# Altium schematic sheet 3V3_REG.SchDoc
size C; SheetNumber: 9; SheetTotal: 25
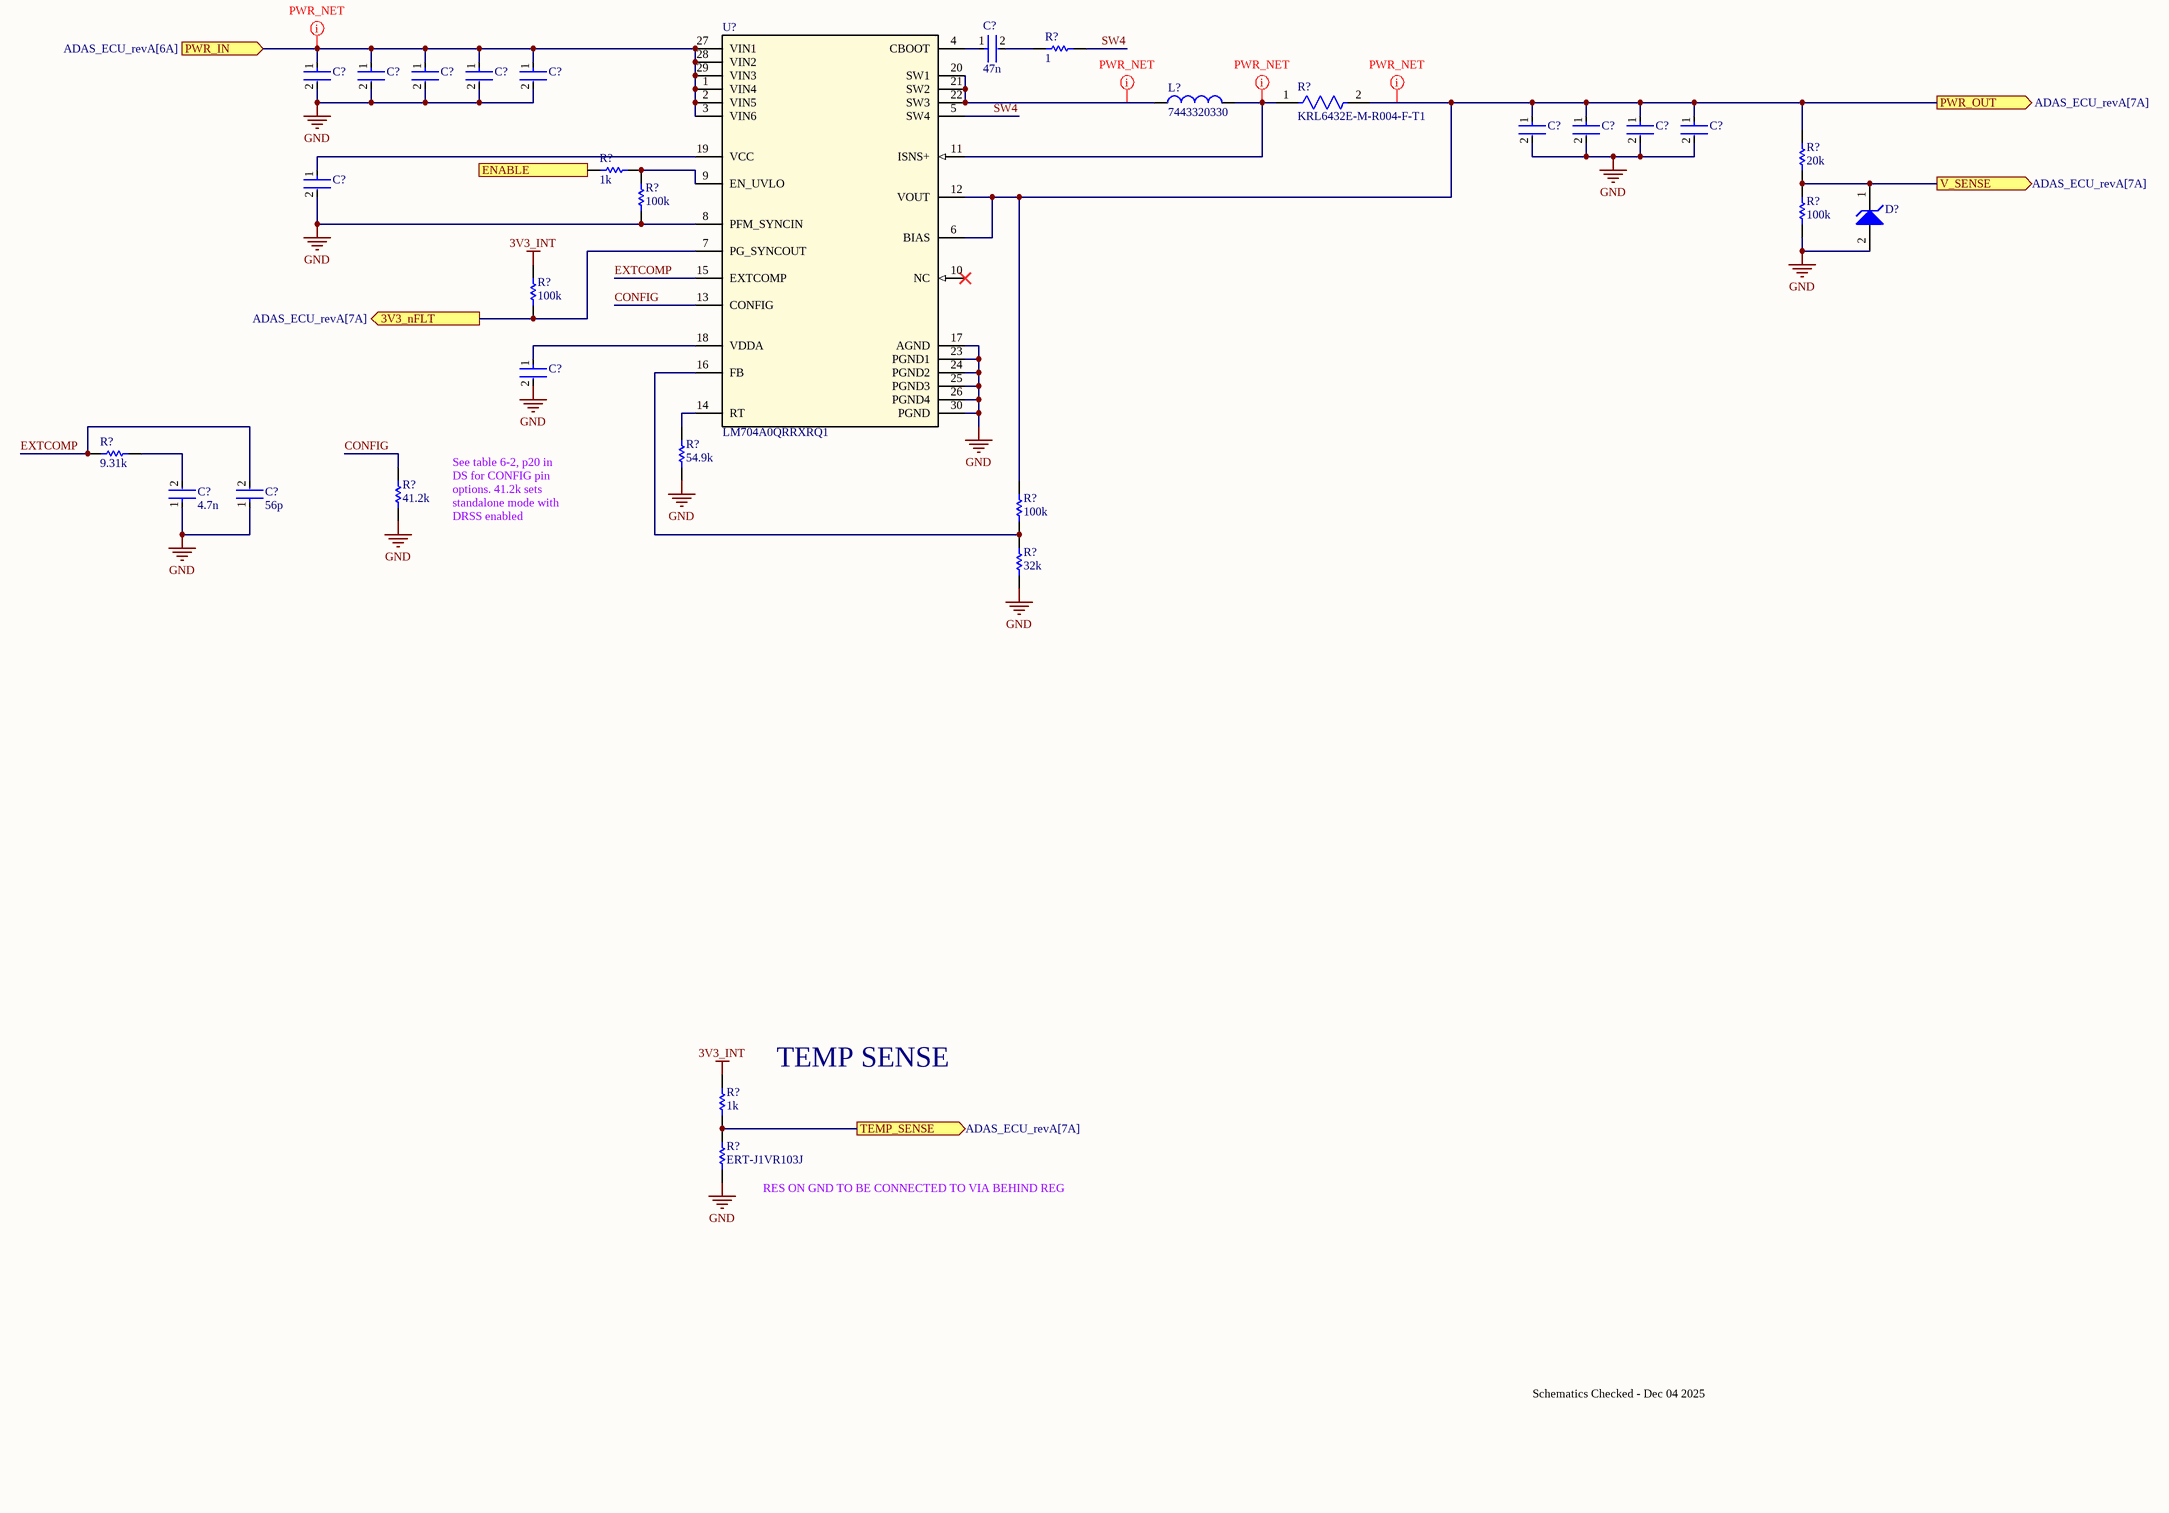
[diagram p0: 3V3_REG.SchDoc]

## Parts
(Parts that share a designator on the sheet are numbered #1, #2 ... from top to bottom, then left to right.)
C?#1  47n  [FP-0402-L_1_0_0_05-W_0_5-IPC_A]
C?#2  C3225X7R1H106M250AC  [FP-C3225-250-0_4-MFG]  (value not drawn)
C?#3  C3225X7R1H106M250AC  [FP-C3225-250-0_4-MFG]  (value not drawn)
C?#4  C3225X7R1H106M250AC  [FP-C3225-250-0_4-MFG]  (value not drawn)
C?#5  C3225X7R1H106M250AC  [FP-C3225-250-0_4-MFG]  (value not drawn)
C?#6  C2012X7R2A104K125AA  [FP-C2012-125-0_2-IPC_B]  (value not drawn)
C?#7  GRM32EC80J107ME20L  [FP-GRM32E-0_3-0_2-IPC_C]  (value not drawn)
C?#8  GRM32EC80J107ME20L  [FP-GRM32E-0_3-0_2-IPC_C]  (value not drawn)
C?#9  GRM32EC80J107ME20L  [FP-GRM32E-0_3-0_2-IPC_C]  (value not drawn)
C?#10  GRM32EC80J107ME20L  [FP-GRM32E-0_3-0_2-IPC_C]  (value not drawn)
C?#11  GRM188R71A225KE15D  [FP-GRM188-0_1-e0_2_0_5-MFG]  (value not drawn)
C?#12  GRM155R61A474KE15D  [FP-GRM15-0_1-MFG]  (value not drawn)
C?#13  4.7n  [FP-0402-L_1_0_0_05-W_0_5-IPC_A]
C?#14  56p  [FP-0402-L_1_0_0_05-W_0_5-IPC_A]
D?  DNP/MM5Z3V3T1G  [ONSC-SOD-523-2-502-01_V]  (value not drawn)
L?  7443320330  [WE-HCC_1210]
R?#1  1  [R0603B]
R?#2  KRL6432E-M-R004-F-T1  [FP-KRL6432E-MFG]
R?#3  20k  [R0603B]
R?#4  1k  [R0603B]
R?#5  100k  [R0603B]
R?#6  100k  [R0603B]
R?#7  100k  [R0603B]
R?#8  9.31k  [R0603B]
R?#9  54.9k  [R0603B]
R?#10  41.2k  [R0603B]
R?#11  100k  [R0603B]
R?#12  32k  [R0603B]
R?#13  1k  [R0603B]
R?#14  ERT-J1VR103J  [RESC1608X90X30ML15T20]
U?  LM704A0QRRXRQ1  [LM704A0QRRXRQ1-Footprint-1]

## Ports
3V3_nFLT (out, see ADAS_ECU_revA[7A]), ENABLE (in), PWR_IN (in, see ADAS_ECU_revA[6A]), PWR_OUT (out, see ADAS_ECU_revA[7A]), TEMP_SENSE (out, see ADAS_ECU_revA[7A]), V_SENSE (out, see ADAS_ECU_revA[7A])

## Nets
3V3_INT: R?#7.2 R?#13.1
GND: C?#2.2 C?#3.2 C?#4.2 C?#5.2 C?#6.2 C?#7.2 C?#8.2 C?#9.2 C?#10.2 C?#11.2 C?#12.2 C?#13.1 C?#14.1 D?.2(A) R?#5.1 R?#6.2 R?#9.2 R?#10.2 R?#12.2 R?#14.1 U?.8(PFM_SYNCIN) U?.17(AGND) U?.23(PGND1) U?.24(PGND2) U?.25(PGND3) U?.26(PGND4) U?.30(PGND)
3V3_nFLT: R?#7.1 U?.7(PG_SYNCOUT) ; port 3V3_nFLT
CONFIG: R?#10.1 U?.13(CONFIG)
ENABLE: R?#4.2 ; port ENABLE
EXTCOMP: C?#14.2 R?#8.1 U?.15(EXTCOMP)
PWR_IN: C?#2.1 C?#3.1 C?#4.1 C?#5.1 C?#6.1 U?.1(VIN4) U?.2(VIN5) U?.3(VIN6) U?.27(VIN1) U?.28(VIN2) U?.29(VIN3) ; port PWR_IN
PWR_OUT: C?#7.1 C?#8.1 C?#9.1 C?#10.1 R?#2.2 R?#3.1 R?#11.1 U?.6(BIAS) U?.12(VOUT) ; port PWR_OUT
SW4: R?#1.2 U?.5(SW4)
TEMP_SENSE: R?#13.2 R?#14.2 ; port TEMP_SENSE
V_SENSE: D?.1(K) R?#3.2 R?#6.1 ; port V_SENSE
NetC?#1_1: C?#1.1 U?.4(CBOOT)
NetC?#1_2: C?#1.2 R?#1.1
NetC?#11_1: C?#11.1 U?.19(VCC)
NetC?#12_1: C?#12.1 U?.18(VDDA)
NetC?#13_2: C?#13.2 R?#8.2
NetL?_1: L?.1 U?.20(SW1) U?.21(SW2) U?.22(SW3)
NetL?_2: L?.2 R?#2.1 U?.11(ISNS+)
NetR?#4_1: R?#4.1 R?#5.2 U?.9(EN_UVLO)
NetR?#9_1: R?#9.1 U?.14(RT)
NetR?#11_2: R?#11.2 R?#12.1 U?.16(FB)

Not connected (* = marked no-connect by the designer): U? 10(NC)*

## Layout directives
net class PWR: NetL?_1, NetL?_2, PWR_IN, PWR_OUT

## Notes on the sheet
- See table 6-2, p20 in DS for CONFIG pin options. 41.2k sets standalone mode with DRSS enabled
- TEMP SENSE
- (near R?#14) RES ON GND TO BE CONNECTED TO VIA BEHIND REG
- Schematics Checked - Dec 04 2025

## Library data of the parts
C?#1 C?#13 C?#14 = CMP-001-00058-1: LARGE PADS, 0402 CAP, CHANGE COMMENT TO MATCH REAL P/N; Capacitor Type: Ceramic; Min Operating Temperature: -55°C; Mounting Technology: Surface Mount; Pins: 2; Case/Package: 0402; RoHS Compliant: Yes; Max Operating Temperature: 85°C
C?#2-C?#5 = CMP-08246-002653-1: Multilayer Ceramic Capacitors 10uF ±20% 50V X7R SMD 1210; Width: 0.098inch; Package Quantity: 1000; Height: 2.5mm; Dielectric Material: Ceramic; Voltage Rating: 50V; Series: C; Capacitance: 10uF; Tolerance: 20%; Weight: 0.000564oz; Case/Package: 1210; Case Code (Imperial): 1210; Dielectric: X7R; Case Code (Metric): 3225; REACH SVHC: No SVHC; Packaging: Tape and Reel; Length: 0.126inch; Termination: SMD/SMT; Min Operating Temperature: -55°C; Voltage Rating (DC): 50V; Lead Free: Lead Free; Max Operating Temperature: 125°C; Thickness: 0.11inch; Mount: Surface Mount
C?#6 = CMP-08246-005364-1: Multilayer Ceramic Capacitors 100nF ±10% 100V X7R SMD 0805; Packaging: Tape and Reel; Length: 2mm; Number of Pins: 2; Voltage Rating: 100V; Min Operating Temperature: -55°C; Height: 1.25mm; Radiation Hardening: No; Termination: SMD/SMT; Weight: 0.000194oz; Case Code (Imperial): 0805; Max Operating Temperature: 125°C; Voltage: 100V; Capacitance: 100nF; Thickness: 0.057inch; Width: 0.049inch; Resistor Type: Ceramic; Package Quantity: 1; Tolerance: 10%; Mount: Surface Mount; Depth: 1.25mm; Series: C; Lead Free: Lead Free; Case/Package: 0805; Voltage Rating (DC): 100V; Dielectric: X7R; Case Code (Metric): 2012; RoHS Compliant: Yes; REACH SVHC: No SVHC; Construction: Flat
C?#7-C?#10 = CMP-2000-06362-2: DIFF P/N 100UF 6.3V GRM32EC80J107ME20L; Voltage: 16V; Tolerance: 10%; Capacitance: 47uF; Dielectric: X5R; Material: Ceramic; Case Code (Metric): 3225; RoHS Compliant: Yes; Min Operating Temperature: -55°C; Radiation Hardening: No; Package Quantity: 1; Case Code (Imperial): 1210; REACH SVHC: No SVHC; Voltage Rating (DC): 16V; Case/Package: 1210; Length: 3.2mm; Voltage Rating: 16V; Packaging: Cut Tape; Width: 0.098inch; Number of Pins: 2; Lead Free: Lead Free; Height: 2.5mm; Mount: Surface Mount; Termination: SMD/SMT; Max Operating Temperature: 85°C; Thickness: 0.106inch; Depth: 2.5mm
C?#11 = CMP-2006-02836-2: Chip Multilayer Ceramic Capacitors for General Purpose, 0603, 2.2uF, X7R, 15%, 10%, 10V; Case Code (Metric): 1608; Height: 0.8mm; Packaging: Cut Tape; Voltage: 10V; Lead Free: Lead Free; Min Operating Temperature: -55°C; Voltage Rating (DC): 10V; Max Operating Temperature: 125°C; Voltage Rating: 10V; Dielectric: X7R; Depth: 0.8mm; Case Code (Imperial): 0603; Termination: SMD/SMT; Case/Package: 0603; Number of Pins: 2; REACH SVHC: No SVHC; Mount: Surface Mount; Width: 0.031inch; Material: Ceramic; Capacitance: 2.2uF; Package Quantity: 1; Weight: 7.1E-05oz; Length: 1.6mm; Thickness: 0.035inch; Tolerance: 10%
C?#12 = CMP-2000-05009-2: CAP CER 0.47UF 10V X5R 0402; Manufacturer: Murata Electronics North America; Temperature Coefficient: 15%; Material: Ceramic; Tolerance: 10%; Device Class L3: Ceramic Capacitors; ComponentLink2Description: Datasheet; ComponentLink2URL: https://search.murata.co.jp/Ceramy/image/img/A01X/G101/ENG/GRM155R61A474KE15-01A.pdf; Package: GRM15-0.1; Voltage Rating: 10V; Capacitance: 0.47uF; Category: Cap; Manufacturer Part Number: GRM155R61A474KE15D; Temperature Range High: +85°C; Temperature Range Low: -55°C; Height: 0.55mm; Device Class L2: Capacitors; Lead Free: Yes; Mouser Description: Multilayer Ceramic Capacitors MLCC - SMD/SMT 0402 0.47uF 10volts X5R 10%; Ipc Land Pattern Name: CAPC10050X50; Temperature Characteristic: X5R; Digikey Description: CAP CER 0.47UF 10V X5R 0402; Value: 0.47uF; Octopart: https://octopart.com/grm155r61a474ke15d-murata-196883; Automotive: No; Device Class L1: Passive Components; Temperature: -55°C to +85°C; RoHS: TRUE
D? = CMP-1060-00750-1: Zener Voltage Regulator, 500 mW, 2-Pin SOD-523, Pb-Free, Tape and Reel; Manufacturer: On Semiconductor; P Max (W): 0.5; VZ Typ (V): 3.3; RoHS: Pb-Free; ComponentLink2Description: Datasheet; PackageReference: SOD-523-2-502-01; DatasheetVersion: Rev. 10; ComponentLink1Description: Manufacturer URL; PackageVersion: Rev. E, 09/2010; ComponentLink3URL: http://www.onsemi.com/pub_link/Collateral/502-01.PDF; ComponentLink2URL: http://www.onsemi.cn/pub_link/Collateral/MM5Z2V4T1-D.PDF; Mounting Technology: Surface Mount; PartNumber: MM5Z3V3T1G; Packing: Tape and Reel; PackageDescription: 2-Pin SOD, Body 1.2 x 0.8 mm; ComponentLink1URL: http://www.onsemi.com/; ComponentLink3Description: Package Specification
L? = CMP-0226-00120-2: NexarPartId: 22803324; Self Resonant Frequency: 44MHz; DC Resistance (DCR): 5.2mΩ; Saturation Current: 22.4A; Inductance Tolerance: 20%; Material: Ferrite; Inductance: 3.3µH; Current Rating: 17A; Height: 9.5mm; Number of Pins: 2; Length: 12.1mm; Width: 11.4mm; Packaging: Tape & Reel (TR); Ambient Temperature Range High: 75°C; RoHS: Compliant; Max Operating Temperature: 125°C; Min Operating Temperature: -40°C; Ambient Temperature Range Low: -40°C; Core Material: Ferrite
R?#1 R?#4-R?#13 = CMP-009-00002-14: Resistor
  R?#6: Value: 100k
  R?#13: Value: 1k
R?#2 = CMP-00597-24927457-1: KRL6432E-M-R004-F-T1 Metal Foil Low Resistance Chip Resistor (long-side terminal), 2512, RoHS; Power Rating: 3W; Temperature Coefficient: 50ppm/°C; Tolerance: 1%; Resistance: 4mΩ; Length: 3.1mm; Composition: Metal Foil; Termination: SMD/SMT; Max Operating Temperature: 155°C; Case Code (Imperial): 2512; NexarPartId: 24927457; Width: 6.3mm; Max Power Dissipation: 3W; Case Code (Metric): 6432; Min Operating Temperature: -55°C; Packaging: Digi-Reel®; Max Thickness: 700µm; Lifecycle Status: Production; Height: 700µm; Weight: 40.511469mg; Case/Package: 2512; RoHS: Compliant; Number of Terminations: 2
R?#3 = CMP-009-00002-14: Resistor; Value: 100k
R?#14 = CMP-2000-00869-1: Manufacturer: Panasonic; Part Number: ERT-J1VR103J
U? = CMP-019-00058-1: Automotive, High-density, 4.5V to 45V input, 10A low-EMI synchronous DC/DC step-down converter 29-VQFN -40 to 150; Case/Package: VQFN; Pins: 29